# Altium schematic sheet if-amp.SchDoc: IF Amplifier
size Legal; CheckedBy: J. Brinton; CompanyName: Signal Laboratories, Inc.; DrawnBy: J. Brinton; Engineer: J. Brinton; Address1: 3479 Edison Way; Address2: Menlo Park CA 94025; Address3: +1 (877) 778-8435; Address4: siglabs.com; DocumentNumber: 51; Revision: 2b; SheetNumber: 52; SheetTotal: 58
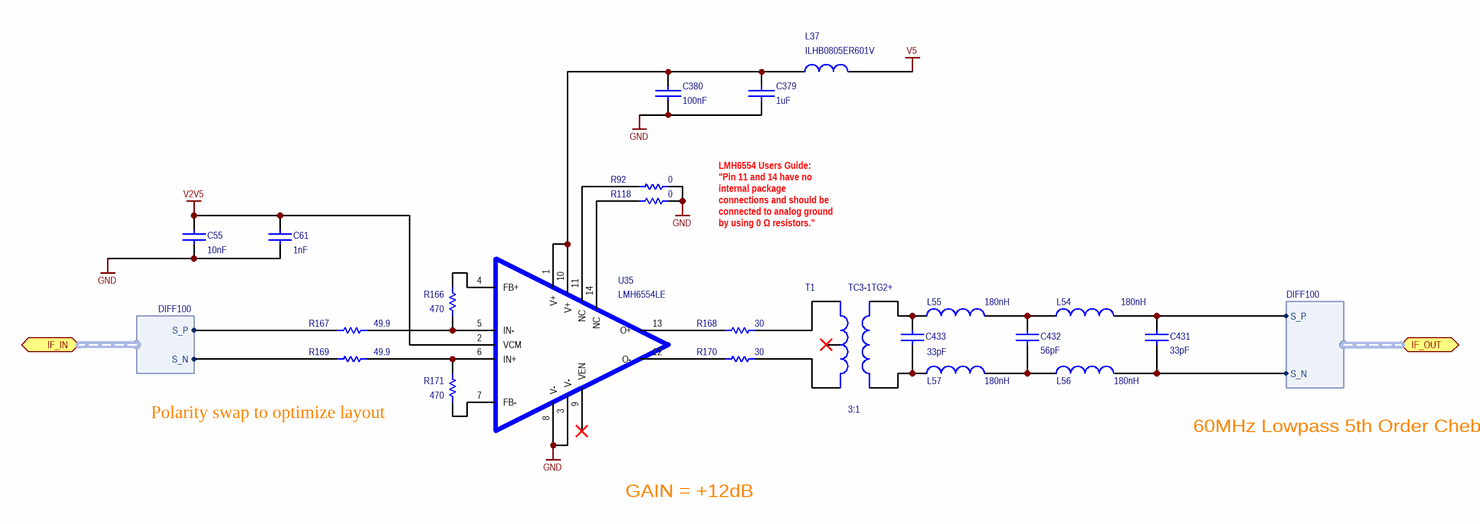
[diagram p0: if-amp.SchDoc]

## Parts
C55  value 10nF  [0402]  (hidden comment: GRM155R71E103KA01D)
C61  value 1nF  [0402]  (hidden comment: GRM1555C1H102JA01D)
C379  value 1uF  [0402]  (hidden comment: GRM155R61A105KE15D)
C380  value 100nF  [0402]  (hidden comment: GRM155R71C104KA88J)
C431  value 33pF  [0402]  (hidden comment: GRM1555C1H330JA01D)
C432  value 56pF  [0402]  (hidden comment: GRM1555C1H560JA01D)
C433  value 33pF  [0402]  (hidden comment: GRM1555C1H330JA01D)
L37  ILHB0805ER601V  [0805]
L54  value 180nH  [0603]  (hidden comment: LQW18ANR18G00D)
L55  value 180nH  [0603]  (hidden comment: LQW18ANR18G00D)
L56  value 180nH  [0603]  (hidden comment: LQW18ANR18G00D)
L57  value 180nH  [0603]  (hidden comment: LQW18ANR18G00D)
R92  value 0  [0402]  (hidden comment: ERJ-2GE0R00X)
R118  value 0  [0402]  (hidden comment: ERJ-2GE0R00X)
R166  value 470  [0402]  (hidden comment: ERA-2AEB471X)
R167  value 49.9  [0402]  (hidden comment: ERA-2AEB49R9X)
R168  value 30  [0402]  (hidden comment: CPF0402B30RE1)
R169  value 49.9  [0402]  (hidden comment: ERA-2AEB49R9X)
R170  value 30  [0402]  (hidden comment: CPF0402B30RE1)
R171  value 470  [0402]  (hidden comment: ERA-2AEB471X)
T1  value 3:1  [AT224-1A]  (hidden comment: TC3-1TG2+)
U35  LMH6554LE  [NHJ0014A]

## Ports
IF_IN (harness DIFF100), IF_OUT (harness DIFF100)

## Harnesses
DIFF100: S_P, S_N

## Nets
GND: C55.1 C61.1 C379.1 C380.1 R92.2 R118.2 U35.3(V-) U35.8(V-)
V2V5: C55.2 C61.2 U35.2(VCM)
V5: L37.2
NetC379_2: C379.2 C380.2 L37.1 U35.1(V+) U35.10(V+)
NetC431_1: C431.1 L56.1 ; port IF_OUT.S_N
NetC431_2: C431.2 L54.1 ; port IF_OUT.S_P
NetC432_1: C432.1 L56.2 L57.1
NetC432_2: C432.2 L54.2 L55.1
NetC433_1: C433.1 L57.2 T1.6(Pri+)
NetC433_2: C433.2 L55.2 T1.4(Pri-)
NetR92_1: R92.1 U35.11(NC)
NetR118_1: R118.1 U35.14(NC)
NetR166_1: R166.1 U35.4(FB+)
NetR166_2: R166.2 R167.1 U35.5(IN-)
NetR167_2: R167.2 ; port IF_IN.S_P
NetR168_1: R168.1 T1.3(Sec-)
NetR168_2: R168.2 U35.13(O+)
NetR169_1: R169.1 R171.1 U35.6(IN+)
NetR169_2: R169.2 ; port IF_IN.S_N
NetR170_1: R170.1 T1.1(Sec+)
NetR170_2: R170.2 U35.12(O-)
NetR171_2: R171.2 U35.7(FB-)

Not connected (* = marked no-connect by the designer): T1 2(SecCT)*; U35 9(VEN)*

## Notes on the sheet
- LMH6554 Users Guide:
  "Pin 11 and 14 have no internal package connections and should be connected to analog ground by using 0 Ω resistors."
- (near R171) Polarity swap to optimize layout
- GAIN = +12dB
- 60MHz Lowpass 5th Order Chebychev Filter, 100-ohm
- Title
- Engineer
- Revision
- Drawn By
- Checked By
- Date
- Sheet
- of

## Library data of the parts
C55 = CAP 0402: Ceramic Capacitor 10nF ±10% 25V X7R 0402; Manufacturer: Murata; Tr: -55:125; Voltage: 25V; Manufacturer P/N: GRM155R71E103KA01D; Package: 0402; Tolerance: ±10%
C61 = CAP 0402: Ceramic Capacitor 1nF ±5% 50V NP0 0402; Manufacturer: Murata; Tr: -55:125; Voltage: 50V; Manufacturer P/N: GRM1555C1H102JA01D; Package: 0402; Tolerance: ±5%
C379 = CAP: Ceramic Capacitor 1uF ±10% 10V X5R 0402; Manufacturer: Murata; Tr: -55:125; Manufacturer P/N: GRM155R61A105KE15D; Package: 0402; Tolerance: ±10%; Voltage: 10V
C380 = CAP: Ceramic Capacitor 100nF ±10% 16V X7R 0402; Manufacturer: Murata; Tr: -55:125; Manufacturer P/N: GRM155R71C104KA88J; Voltage: 16V; Package: 0402; Tolerance: ±10%
C431 C433 = CAP 0402: Ceramic Capacitor 33pF ±5% 50V NP0 0402; Manufacturer: Murata; Tr: -55:125; Voltage: 50V; Manufacturer P/N: GRM1555C1H330JA01D; Package: 0402; Tolerance: ±5%
C432 = CAP 0402: Ceramic Capacitor 56pF ±5% 50V NP0 0402; Manufacturer: Murata; Tr: -55:125; Voltage: 50V; Manufacturer P/N: GRM1555C1H560JA01D; Package: 0402; Tolerance: ±5%
L37 = INDUCTANCE1: Ferrite Bead 600-Ohm @ 100MHz 2A 0805; Manufacturer: Vishay Dale; Value: 600@100MHz; Tolerance: ±25%; Tr: -55:125; Manufacturer P/N: ILHB0805ER601V; Package: 0805
L54-L57 = INDUCTOR: Inductor Wirewound 180nH ±2% 0603; Manufacturer: Murata; Tr: -55:125; Manufacturer P/N: LQW18ANR18G00D; Package: 0603; Tolerance: ±2%
R92 R118 = RES 0402: Thick Film Resistor Jumper 0402; Manufacturer: Panasonic; Tr: -55:155; Package: 0402; Manufacturer P/N: ERJ-2GE0R00X; Tolerance: 0
R166 R171 = RES 0402: Thin Film Resistor 470 ±0.1% 0402; Manufacturer: Panasonic; Tr: -55:155; Package: 0402; Manufacturer P/N: ERA-2AEB471X; Tolerance: ±0.1%
R167 R169 = RES 0402: Thin Film Resistor 49.9 ±0.1% 0402; Manufacturer: Panasonic; Tr: -55:155; Package: 0402; Manufacturer P/N: ERA-2AEB49R9X; Tolerance: ±0.1%
R168 R170 = RES 0402: Thin Film Resistor 30 ±0.1% 0402; Manufacturer: TE Connectivity; Tr: -55:155; Package: 0402; Manufacturer P/N: CPF0402B30RE1; Tolerance: 0.1%
T1 = TC1-1TG2+: RF Transformer 0.4 to 500MHz SMD; Manufacturer: Mini-Circuits; Manufacturer P/N: TC3-1TG2+
U35 = LMH6554LE: 2.8 GHz Ultra Linear Fully Differential Amplifier; Manufacturer: Texas Instruments; Manufacturer P/N: LMH6554LE